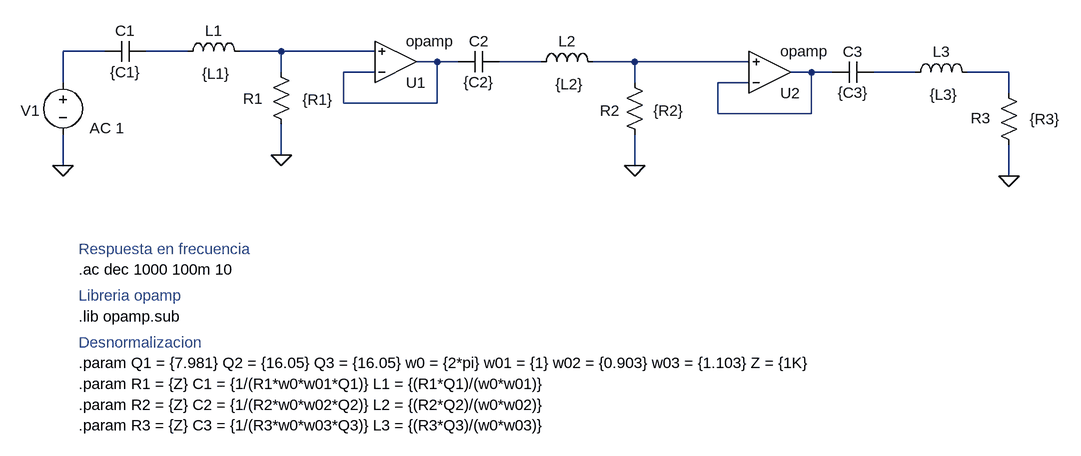
[diagram p0: schematic Circuito_Semana_Bis_Bis_RLC.asc]
Circuito_Semana_Bis_Bis_RLC.asc, the LTspice schematic file:
Version 4
SHEET 1 968 680
WIRE -512 -208 -576 -208
WIRE -384 -208 -448 -208
WIRE -240 -208 -304 -208
WIRE -96 -208 -240 -208
WIRE 0 -192 -32 -192
WIRE 32 -192 0 -192
WIRE 160 -192 96 -192
WIRE 304 -192 240 -192
WIRE 480 -192 304 -192
WIRE -240 -176 -240 -208
WIRE -96 -176 -144 -176
WIRE 576 -176 544 -176
WIRE 608 -176 576 -176
WIRE 736 -176 672 -176
WIRE 880 -176 816 -176
WIRE -576 -160 -576 -208
WIRE 304 -160 304 -192
WIRE 480 -160 432 -160
WIRE 880 -144 880 -176
WIRE -144 -128 -144 -176
WIRE 0 -128 0 -192
WIRE 0 -128 -144 -128
WIRE 432 -112 432 -160
WIRE 576 -112 576 -176
WIRE 576 -112 432 -112
WIRE -240 -48 -240 -96
WIRE -576 -32 -576 -80
WIRE 304 -32 304 -80
WIRE 880 -16 880 -64
FLAG -576 -32 0
FLAG -240 -48 0
FLAG 304 -32 0
FLAG 880 -16 0
SYMBOL res -224 -80 R180
WINDOW 0 44 55 Left 2
WINDOW 3 -64 54 Left 2
SYMATTR InstName R1
SYMATTR Value {R1}
SYMBOL ind -400 -192 R270
WINDOW 0 32 56 VTop 2
WINDOW 3 -3 60 VBottom 2
SYMATTR InstName L1
SYMATTR Value {L1}
SYMBOL cap -448 -224 R90
WINDOW 0 0 32 VBottom 2
WINDOW 3 32 32 VTop 2
SYMATTR InstName C1
SYMATTR Value {C1}
SYMBOL OpAmps\\opamp -64 -128 M180
SYMATTR InstName U1
SYMBOL voltage -576 -176 R0
WINDOW 0 -65 59 Left 2
WINDOW 3 41 58 Left 2
WINDOW 123 41 86 Left 2
WINDOW 39 0 0 Left 0
SYMATTR InstName V1
SYMATTR Value ""
SYMATTR Value2 AC 1
SYMBOL res 320 -64 R180
WINDOW 0 39 53 Left 2
WINDOW 3 -60 53 Left 2
SYMATTR InstName R2
SYMATTR Value {R2}
SYMBOL ind 144 -176 R270
WINDOW 0 32 56 VTop 2
WINDOW 3 -3 60 VBottom 2
SYMATTR InstName L2
SYMATTR Value {L2}
SYMBOL cap 96 -208 R90
WINDOW 0 0 32 VBottom 2
WINDOW 3 32 32 VTop 2
SYMATTR InstName C2
SYMATTR Value {C2}
SYMBOL res 896 -48 R180
WINDOW 0 44 57 Left 2
WINDOW 3 -63 56 Left 2
SYMATTR InstName R3
SYMATTR Value {R3}
SYMBOL ind 720 -160 R270
WINDOW 0 32 56 VTop 2
WINDOW 3 -3 60 VBottom 2
SYMATTR InstName L3
SYMATTR Value {L3}
SYMBOL cap 672 -192 R90
WINDOW 0 0 32 VBottom 2
WINDOW 3 32 32 VTop 2
SYMATTR InstName C3
SYMATTR Value {C3}
SYMBOL OpAmps\\opamp 512 -112 M180
SYMATTR InstName U2
TEXT -552 128 Left 2 !.ac dec 1000 100m 10
TEXT -552 200 Left 2 !.lib opamp.sub
TEXT -552 96 Left 2 ;Respuesta en frecuencia
TEXT -552 168 Left 2 ;Libreria opamp
TEXT -552 272 Left 2 !.param Q1 = {7.981} Q2 = {16.05} Q3 = {16.05} w0 = {2*pi} w01 = {1} w02 = {0.903} w03 = {1.103} Z = {1K}
TEXT -552 304 Left 2 !.param R1 = {Z} C1 = {1/(R1*w0*w01*Q1)} L1 = {(R1*Q1)/(w0*w01)}
TEXT -552 336 Left 2 !.param R2 = {Z} C2 = {1/(R2*w0*w02*Q2)} L2 = {(R2*Q2)/(w0*w02)}
TEXT -552 240 Left 2 ;Desnormalizacion
TEXT -552 368 Left 2 !.param R3 = {Z} C3 = {1/(R3*w0*w03*Q3)} L3 = {(R3*Q3)/(w0*w03)}

The netlist it stands for:
* Circuito_Semana_Bis_Bis_RLC.asc
R1 0 N003 {R1}
L1 N002 N003 {L1}
C1 N002 N001 {C1}
XU1 N004 N003 N004 opamp Aol=100K GBW=10Meg  ; pins invin noninvin out
V1 N001 0 AC 1
R2 0 N006 {R2}
L2 N005 N006 {L2}
C2 N005 N004 {C2}
R3 0 N009 {R3}
L3 N008 N009 {L3}
C3 N008 N007 {C3}
XU2 N007 N006 N007 opamp Aol=100K GBW=10Meg  ; pins invin noninvin out
.ac dec 1000 100m 10
.lib opamp.sub
* Respuesta en frecuencia
* Libreria opamp
.param Q1 = {7.981} Q2 = {16.05} Q3 = {16.05} w0 = {2*pi} w01 = {1} w02 = {0.903} w03 = {1.103} Z = {1K}
.param R1 = {Z} C1 = {1/(R1*w0*w01*Q1)} L1 = {(R1*Q1)/(w0*w01)}
.param R2 = {Z} C2 = {1/(R2*w0*w02*Q2)} L2 = {(R2*Q2)/(w0*w02)}
* Desnormalizacion
.param R3 = {Z} C3 = {1/(R3*w0*w03*Q3)} L3 = {(R3*Q3)/(w0*w03)}
.backanno
.end